# Altium schematic sheet SC940D_STORRM.SchDoc: Sorties TOR Relais Monostable
size 393 x 270 mm; CompanyName: Seccom; Address1: 521, rue du capt. François Garbit; Address2: 69440 Mornant; Address3: seccom@seccom.fr; Address4: www.seccom.fr; DocumentNumber: 5; SheetNumber: 5; SheetTotal: 8; PageSetup: Record=PageOptions|CenterHorizontal=True|CenterVertical=True|PrintScale=0.74|XCorrection=1.00|YCorrection=1.00|PrintKind=0|BorderSize=5000000|LeftOffset=0|BottomOffset=0|Orientation=2|PaperLength=1000|PaperWidth=1000|Scale=100|PaperSource=7|PrintQuality=-4|MediaType=1|DitherType=10|PaperKind=A4|PrintScaleMode=1
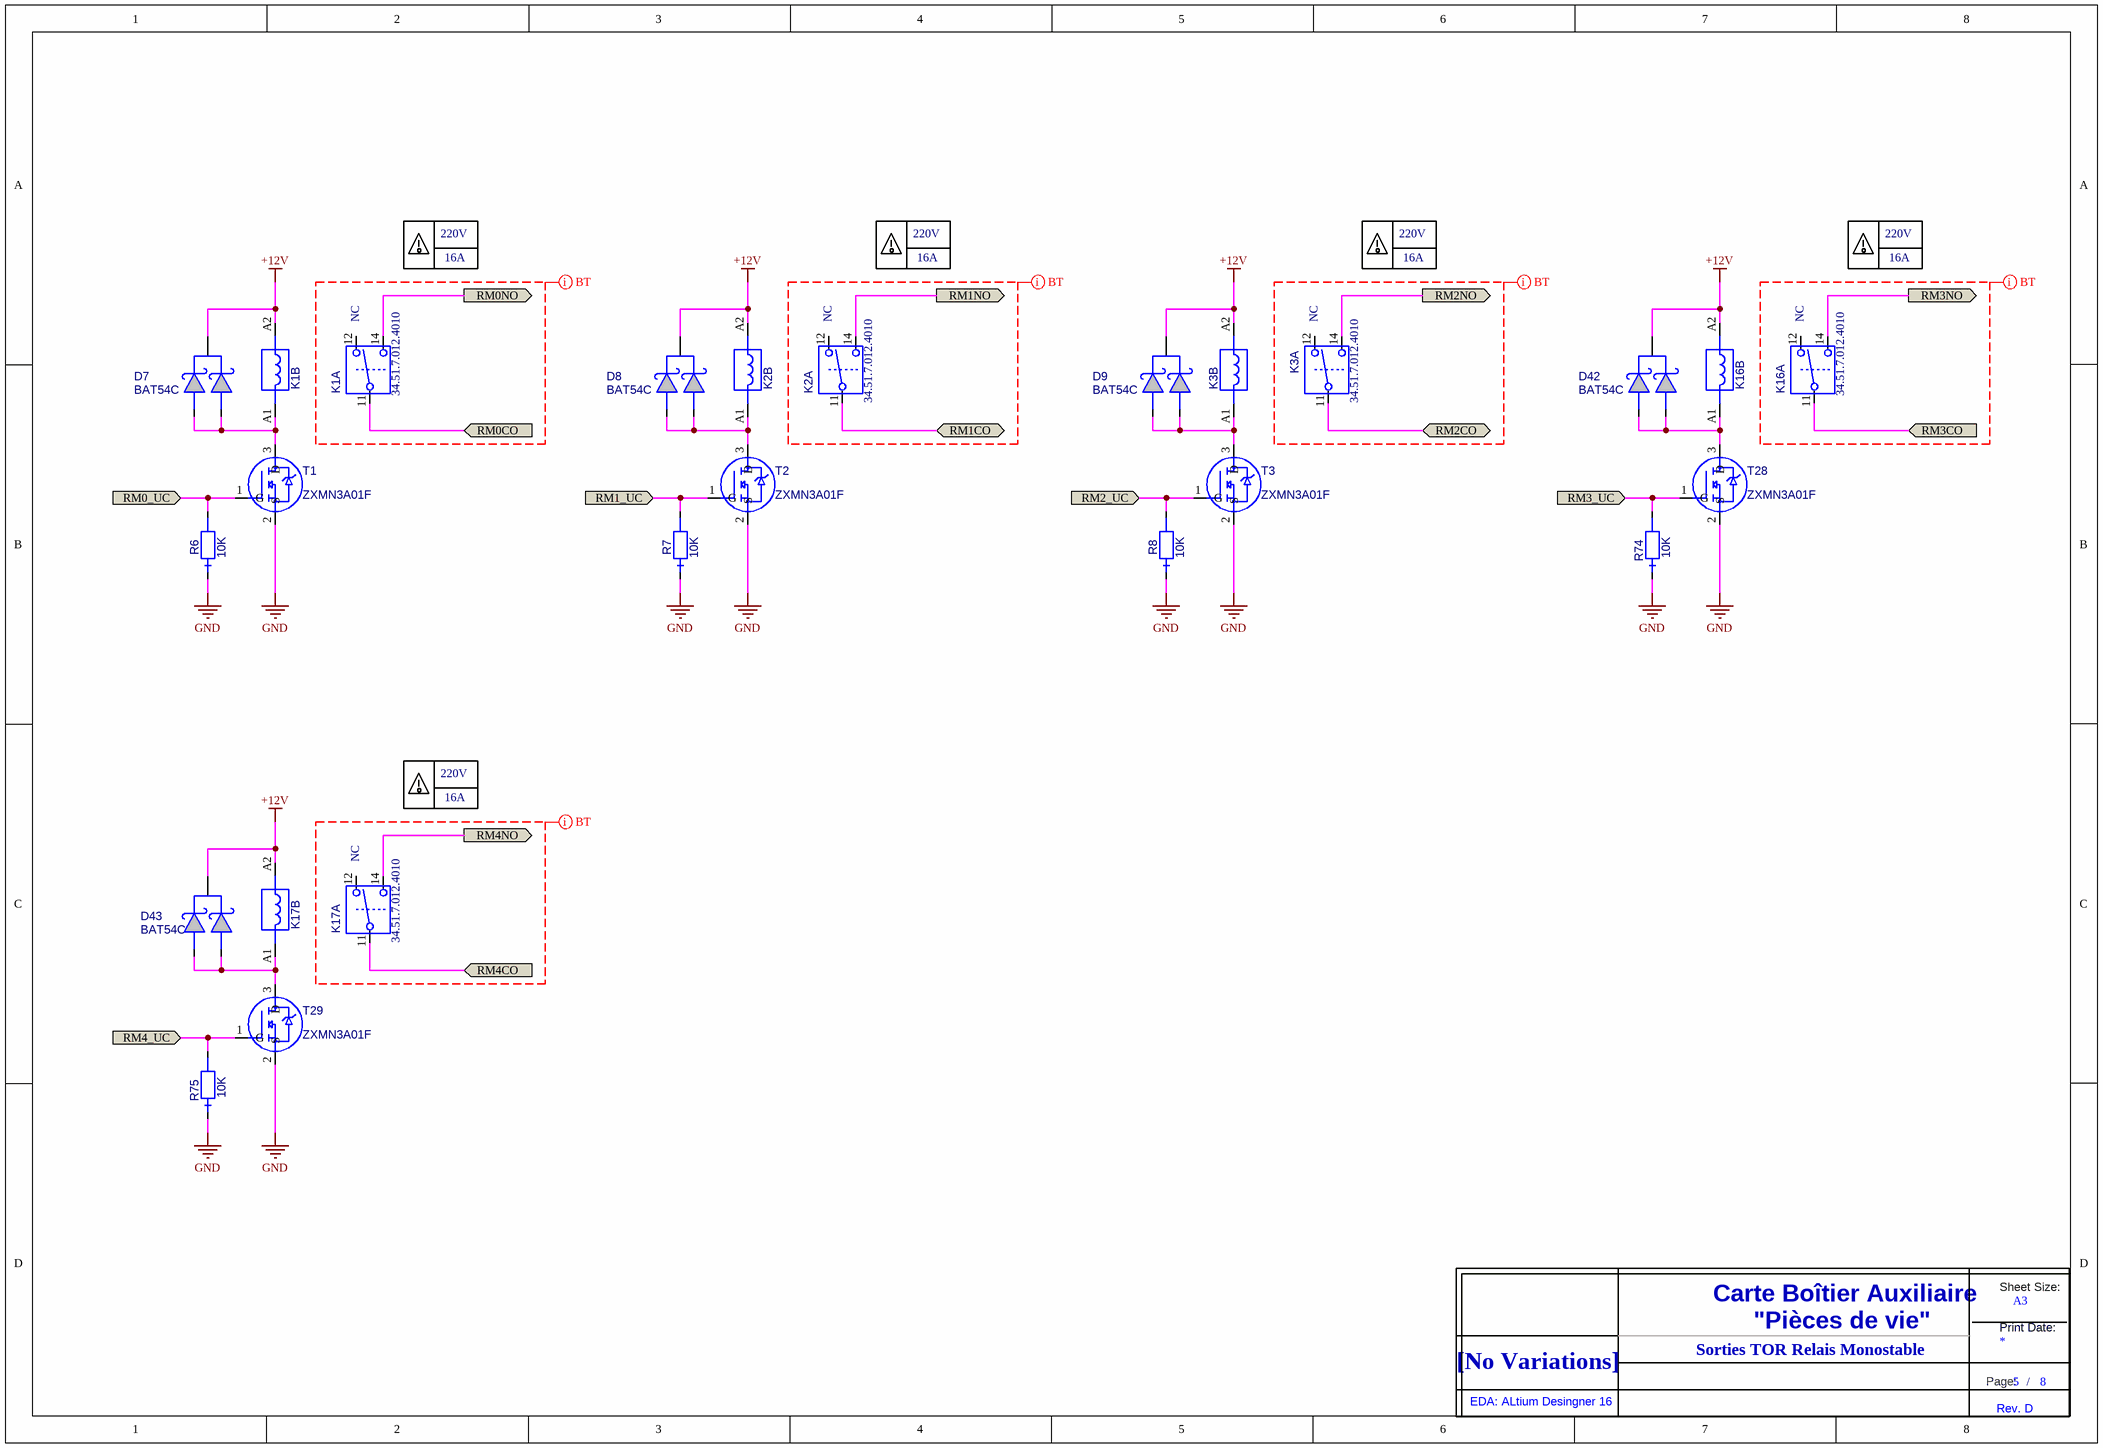
[diagram p0: SC940D_STORRM.SchDoc]

## Parts
D7  BAT54C  [SOT23_3L_ReflowSoldering]
D8  BAT54C  [SOT23_3L_ReflowSoldering]
D9  BAT54C  [SOT23_3L_ReflowSoldering]
D42  BAT54C  [SOT23_3L_ReflowSoldering]
D43  BAT54C  [SOT23_3L_ReflowSoldering]
K1  value 34.51.7.012.4010  [RELAY_FINDER_34.51_+SUPPORT_93]  (hidden comment: RELAY_12VDC_1RT_34.51)  (parts A,B of 2)
K2  RELAY_12VDC_1RT_34.51  [RELAY_FINDER_34.51_+SUPPORT_93]  (value not drawn)  (parts A,B of 2)
K3  value 34.51.7.012.4010  [RELAY_FINDER_34.51_+SUPPORT_93]  (hidden comment: RELAY_12VDC_1RT_34.51)  (parts A,B of 2)
K16  RELAY_12VDC_1RT_34.51  [RELAY_FINDER_34.51_+SUPPORT_93]  (value not drawn)  (parts A,B of 2)
K17  value 34.51.7.012.4010  [RELAY_FINDER_34.51_+SUPPORT_93]  (hidden comment: RELAY_12VDC_1RT_34.51)  (parts A,B of 2)
R6  value 10K  [0805_ReflowSoldering_RES]  (hidden comment: RES_0805_1%_100PPM_10K)
R7  value 10K  [0805_ReflowSoldering_RES]  (hidden comment: RES_0805_1%_100PPM_10K)
R8  value 10K  [0805_ReflowSoldering_RES]  (hidden comment: RES_0805_1%_100PPM_10K)
R74  value 10K  [0805_ReflowSoldering_RES]  (hidden comment: RES_0805_1%_100PPM_10K)
R75  value 10K  [0805_ReflowSoldering_RES]  (hidden comment: RES_0805_1%_100PPM_10K)
T1  ZXMN3A01F  [SOT23_3L_ReflowSoldering]
T2  ZXMN3A01F  [SOT23_3L_ReflowSoldering]
T3  ZXMN3A01F  [SOT23_3L_ReflowSoldering]
T28  ZXMN3A01F  [SOT23_3L_ReflowSoldering]
T29  ZXMN3A01F  [SOT23_3L_ReflowSoldering]
Title_new  DNI  (value not drawn)  (graphical)

## Ports
RM0_UC (in), RM0CO (in), RM0NO (out), RM1_UC (in), RM1CO, RM1NO (out), RM2_UC (in), RM2CO, RM2NO (out), RM3_UC (in), RM3CO (in), RM3NO (out), RM4_UC (in), RM4CO (in), RM4NO (out)

## Nets
+12V: D7.3 D8.3 D9.3 D42.3 D43.3 K1.A2 K2.A2 K3.A2 K16.A2 K17.A2
GND: R6.1 R7.1 R8.1 R74.1 R75.1 T1.2(S) T2.2(S) T3.2(S) T28.2(S) T29.2(S)
RM0_UC: R6.2 T1.1(G) ; port RM0_UC
RM0CO: K1.11(COM) ; port RM0CO
RM0NO: K1.14(NO) ; port RM0NO
RM1_UC: R7.2 T2.1(G) ; port RM1_UC
RM1CO: K2.11(COM) ; port RM1CO
RM1NO: K2.14(NO) ; port RM1NO
RM2_UC: R8.2 T3.1(G) ; port RM2_UC
RM2CO: K3.11(COM) ; port RM2CO
RM2NO: K3.14(NO) ; port RM2NO
RM3_UC: R74.2 T28.1(G) ; port RM3_UC
RM3CO: K16.11(COM) ; port RM3CO
RM3NO: K16.14(NO) ; port RM3NO
RM4_UC: R75.2 T29.1(G) ; port RM4_UC
RM4CO: K17.11(COM) ; port RM4CO
RM4NO: K17.14(NO) ; port RM4NO
NetD7_1: D7.1 D7.2 K1.A1 T1.3(D)
NetD8_1: D8.1 D8.2 K2.A1 T2.3(D)
NetD9_1: D9.1 D9.2 K3.A1 T3.3(D)
NetD42_1: D42.1 D42.2 K16.A1 T28.3(D)
NetD43_1: D43.1 D43.2 K17.A1 T29.3(D)

Not connected (* = marked no-connect by the designer): K1 12(NC); K2 12(NC); K3 12(NC); K16 12(NC); K17 12(NC)

## Layout directives
net class BT: (no net found under the mark)

## Notes on the sheet
- 220V
- (near K1) NC
- 16A
- (near K2) NC
- (near K3) NC
- (near K16) NC
- (near K17) NC
- Sorties TOR Relais Monostable
- (in symbol Title_new) Sheet Size:; Carte Boîtier Auxiliaire; A3; "Pièces de vie"; Print Date:; [No Variations]; Page:; /; EDA: ALtium Desingner 16; Rev. D

## Library data of the parts
D7-D9 D42 D43 = BAT54C: Diode Schottky double, BAT54 cathode com, Vrrm=30V, If=300mA, Vf=0.4Vmax, CMS; Creation: LJ (14/05/02); Reference: 000597/00; Boitier: SOT23_3L; Remarque: {Remarque}; Fabricant: NXP; Coeff: 1; Verification: LJ (14/05/02); Ref Fab: BAT54C; ComponentLink1URL: o:\_Documentation\Datasheets\NXP\BAT54_series.pdf; ComponentLink2URL: o:\_Documentation\Datasheets\_BOITIERS\ACTIF_CMS\SOT\SOT_23_3P_(Schneider).PDF; Config: *; ComponentLink1Description: Datasheet; ComponentLink2Description: Datasheet Boitier; Value: BAT54C; Supplier 1: Farnell; Supplier Part Number 1: 1081192
K1 K3 K17 = RELAY_12VDC_1RT_34.51: Relais 1RT, 12Vdc, série 34.51, Rc=1940R, Sw:250Vac/6A, Ron=? (AgSnO2); Creation: CHD; Verification: LJ (24/11/11); Boitier: DIP12 Form C; Remarque: {Remarque}; Fabricant: Finder; Coeff: 1; Ref Fab: 34.51.7.012.4010; ComponentLink1URL: o:\_Documentation\Datasheets\Finder\Relais_Serie_34.pdf; ComponentLink2URL: o:\_Documentation\Datasheets\_BOITIERS\; Config: *; ComponentLink1Description: Datasheet; ComponentLink2Description: Datasheet Boitier
K2 K16 = RELAY_12VDC_1RT_34.51: Relais 1RT, 12Vdc, série 34.51, Rc=1940R, Sw:250Vac/6A, Ron=? (AgSnO2); Creation: CHD; Verification: LJ (24/11/11); Boitier: DIP12 Form C; Remarque: {Remarque}; Fabricant: Finder; Ref Fab: 34.51.7.012.4010; Coeff: 1; Value: 34.51.7.012.4010; ComponentLink1URL: o:\_Documentation\Datasheets\Finder\Relais_Serie_34.pdf; ComponentLink2URL: o:\_Documentation\Datasheets\_BOITIERS\; Config: *; ComponentLink1Description: Datasheet; ComponentLink2Description: Datasheet Boitier
R6-R8 R74 R75 = RES_0805_1%_100PPM_10K: Résistance CMS 0805, 0.125W, 1%, 100ppm, 150V; Creation: LJ (06/02/09); Reference: 000063/00; Boitier: 0805; Remarque: {Remarque}; Fabricant: Yageo; Ref Fab: RC0805FR-0710KL; Coeff: 1; Verification: *; ComponentLink1URL: o:\_Documentation\Datasheets\BC_Components\Resistances_ThickFilmFlatChip_0402-0603-0805-1206.pdf; ComponentLink2URL: o:\_Documentation\Datasheets\_BOITIERS\PASSIF_CMS\RC_0805_(2x1,25)_(Schneider).PDF; Config: *; ComponentLink1Description: Datasheet; ComponentLink2Description: Datasheet Boitier; Supplier 1: Farnell; Supplier Part Number 1: 9237755
T1-T3 T28 T29 = ZXMN3A01F: Transistor MOSN logique, Vdss=30V, Id=2A, Rdson=0.12R, CMS; Boitier: SOT23_3L; Remarque: {Remarque}; Creation: CHD; Fabricant: Zetex; Coeff: 1; Ref Fab: ZXMN3A01F; ComponentLink1URL: o:\_Documentation\Datasheets\; ComponentLink2URL: o:\_Documentation\Datasheets\_BOITIERS\ACTIF_CMS\SOT\SOT_23_3P_(Schneider).PDF; Config: *; ComponentLink1Description: Datasheet; Value: ZXMN3A01F; Supplier 1: Farnell; Supplier 2: Mouser; Supplier Part Number 1: 9525734; Supplier Part Number 2: 522-ZXMN3A01FTA
Title_new = Title_new